# Altium schematic sheet [8]ADC_chip.SchDoc
size A3; DocumentNumber: 8; SheetNumber: 8; SheetTotal: 11
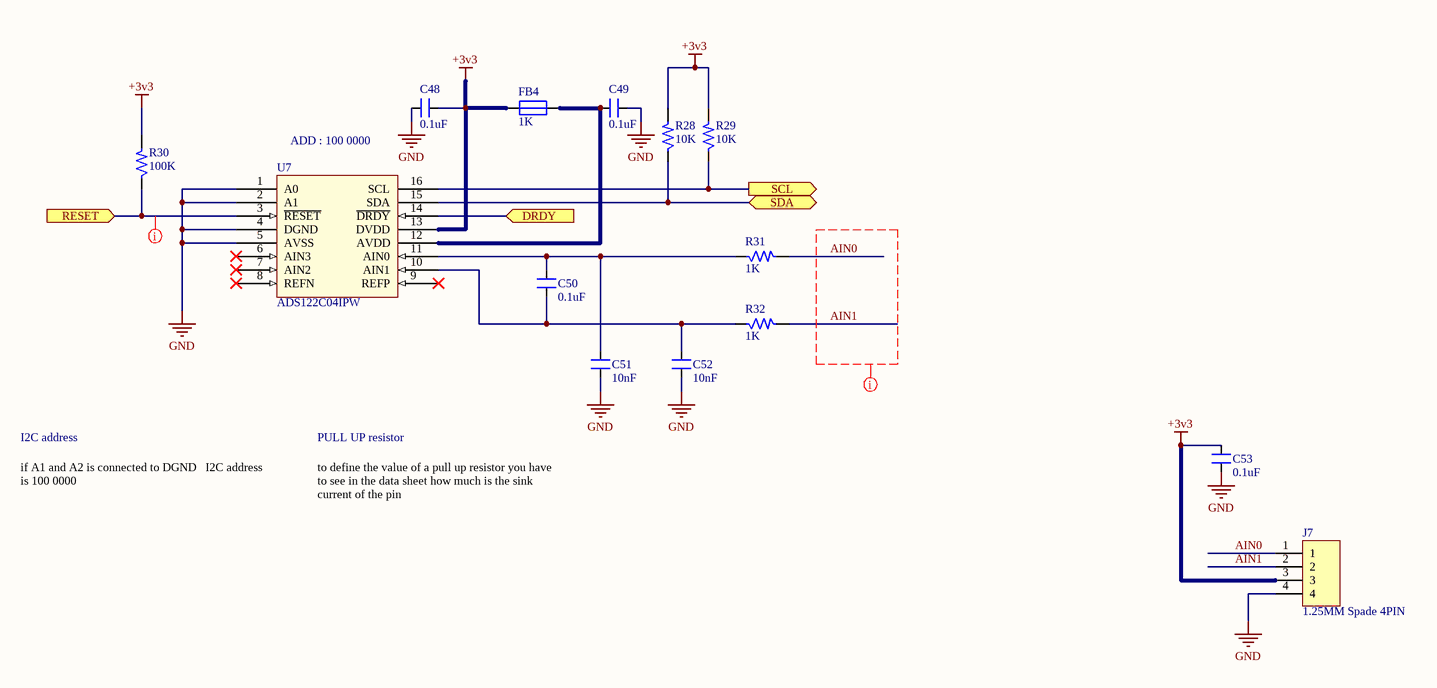
[diagram p0: [8]ADC_chip.SchDoc]

## Parts
C48  0.1uF  [CAP_0805]
C49  0.1uF  [CAP_0805]
C50  0.1uF  [CAP_0805]
C51  10nF  [CAP_0805]
C52  10nF  [CAP_0805]
C53  0.1uF  [CAP_0805]
FB4  1K  [IND_0805]
J7  1.25MM Spade 4PIN  [CON4_50_653004117322_TH_RA]
R28  10K  [RES_0603]
R29  10K  [RES_0603]
R30  100K  [RES_0603]
R31  1K  [RES_0603]
R32  1K  [RES_0603]
U7  ADS122C04IPW  [TSSOP16_25-59_294_54X14_SMT]

## Ports
DRDY (in), RESET (in), SCL (out), SDA (bidir)

## Nets
+3v3: C48.2 C53.2 FB4.1 J7.3 R28.2 R29.2 R30.2 U7.13(DVDD)
GND: C48.1 C49.2 C51.1 C52.1 C53.1 J7.4 U7.1(A0) U7.2(A1) U7.4(DGND) U7.5(AVSS)
AIN0: J7.1 R31.2
AIN1: J7.2 R32.2
DRDY: U7.14(~{DRDY}) ; port DRDY
RESET: R30.1 U7.3(~{RESET}) ; port RESET
SCL: R29.1 U7.16(SCL) ; port SCL
SDA: R28.1 U7.15(SDA) ; port SDA
NetC49_1: C49.1 FB4.2 U7.12(AVDD)
NetC50_1: C50.1 C52.2 R32.1 U7.10(AIN1)
NetC50_2: C50.2 C51.2 R31.1 U7.11(AIN0)

Not connected (* = marked no-connect by the designer): U7 6(AIN3)* 7(AIN2)* 8(REFN)* 9(REFP)*

## Layout directives
net class Critical nets: AIN0, AIN1, RESET

## Notes on the sheet
- ADD : 100 0000
- I2C address
- PULL UP resistor
- if A1 and A2 is connected to DGND   I2C address is 100 0000
- to define the value of a pull up resistor you have to see in the data sheet how much is the sink current of the pin
- Title
- Size:
- Date:
- A3
- Number:
- Time:
- Revision:
- Sheet
- of
- File:

## Library data of the parts
C48-C50 C53 = CAP_0.1uF-50V-5%-0805: 0.1µF ±5% 50V Ceramic Capacitor X7R 0805 (2012 Metric) /; Manufacturer: AVX Corporation; Manufacturer Part Number: 08055C104JAT4A; Alternate Part Number-1: 0805B104M500; Case/Package: 0805; Supplier-1: SIRICOM; Supplier Part Number-1: 0805B104J500CT
C51 C52 = CAP_10nF-50V-10%-0805: 10000pF ±10% 50V Ceramic Capacitor X7R 0805 (2012 Metric) /; Manufacturer: Samsung; Manufacturer Part Number: C0805C103K5RECAUTO; Alternate Part Number-1: GRM2195C1H103JA01D; Case/Package: 0805; Supplier-1: SIRICOM; Supplier Part Number-1: 0805B103K500CT
FB4 = FB_1K-100MHZ-1.6A-0805: 1 kOhms @ 100MHz 1 Power Line Ferrite Bead 0805 (2012 Metric) 1.6A; Manufacturer: Laird; Manufacturer Part Number: BLM21SP102SH1D; Alternate Part Number-1: NA; Case/Package: 0805; Supplier-1: SIRICOM; Supplier Part Number-1: ACMS201209A102
J7 = CON-PLG_4X1-50-RA-TH: 4 Pins, 1 Row 1.25mm Pitch, right angle Connector, male; Manufacturer Part Number: 653004117322; Manufacturer: JST; Mating Part Number: 653004113322; Crimp Part Number: 653153128130; Alternate Part Number-1: NA; Case/Package: TH-CON; Supplier-1: WURTH; Supplier Part Number-1: 653004117322
R28 R29 = RES_10K-0.1W-1%-0603: 10 kOhms ±1% 0.1W, 1/10W Chip Resistor 0603 (1608 Metric) Automotive AEC-Q200 Thick Film /; Manufacturer: Walsin; Manufacturer Part Number: WR06X1002FTL; Alternate Part Number-1: 0603WAJ0103T5E; Case/Package: 0603; Supplier-1: SIRICOM; Supplier Part Number-1: WR06X1002FTL
R30 = RES_100K-0.1W-1%-0603: 100 kOhms ±1% 0.1W, 1/10W Chip Resistor 0603 (1608 Metric) Automotive AEC-Q200 Thick Film /; Manufacturer: Stackpole Electronics; Manufacturer Part Number: RMCF0603FT100K; Alternate Part Number-1: NA; Case/Package: 0603; Supplier-1: Arrow; Supplier Part Number-1: RMCF0603FT100K
R31 R32 = RES_1K-0.1W-1%-0603: 1 kOhms ±1% 0.1W, 1/10W Chip Resistor 0603 (1608 Metric) Automotive AEC-Q200 Thick Film /; Manufacturer: Walsin; Manufacturer Part Number: WR06X1001FTL; Alternate Part Number-1: 0603WAF1001T5E; Case/Package: 0603; Supplier-1: SIRICOM; Supplier Part Number-1: WR06X1001FTL
U7 = IC_ADS122C04IPW: 24 Bit Analog to Digital Converter 4 Input 1 Sigma-Delta 16-TSSOP; Manufacturer: Texas Instruments; Alternate Part Number-1: NA; Manufacturer Part Number: ADS122C04IPW; Case/Package: TSSOP16; Supplier-1: MOUSER; Supplier Part Number-1: ADS122C04IPW